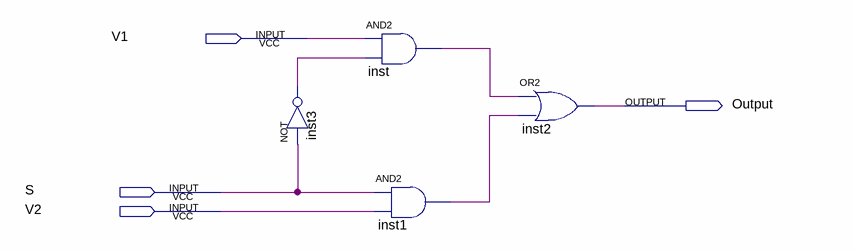
[diagram p0: schematic sheet]
// Quartus schematic 2Mux.bdf as structural Verilog: 4 symbols, 4 pins
module \2Mux  (
  input  V1,
  input  S,
  input  V2,
  output Output
);

  wire inst1_out, inst3_out, inst_out;

  not inst3 (inst3_out, S);
  and inst (inst_out, V1, inst3_out);
  and inst1 (inst1_out, S, V2);
  or inst2 (Output, inst_out, inst1_out);
endmodule
